# Altium schematic sheet FastCharge.SchDoc
size A
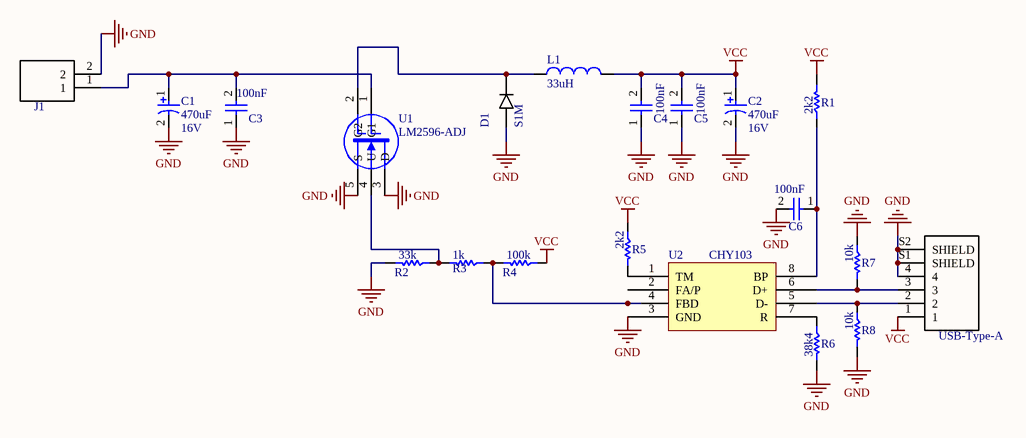
[diagram p0: FastCharge.SchDoc]

## Parts
C1  470uF  [RB5-10.5]
C2  470uF  [RB5-10.5]
C3  100nF  [6-0805_L]
C4  100nF  [6-0805_L]
C5  100nF  [6-0805_L]
C6  100nF  [6-0805_L]
D1  S1M  [*DIOM5227X270N_S1M(Primary)]
J1  6-1123723-2  [*TE_6-1123723-2]  (value not drawn)
L1  33uH  [IND_SMD-13.0mm]
R1  2k2  [6-0805_L]
R2  33k  [6-0805_L]
R3  1k  [6-0805_L]
R4  100k  [6-0805_L]
R5  2k2  [6-0805_L]
R6  38k4  [6-0805_L]
R7  10k  [6-0805_L]
R8  10k  [6-0805_L]
U1  LM2596-ADJ  [T05A]
U2  CHY103  [8 pin SOIC_L]
USB-Type-A  1-292303-1  [*TE_1-292303-1_1-292303-1(Primary)]  (value not drawn)

## Nets
GND: C1.2 C2.2 C3.1 C4.1 C5.1 C6.2 D1.A J1.2 R2.2 R6.2 R7.1 R8.2 U1.3(D) U1.5(S) U2.3(GND) USB-Type-A.4 USB-Type-A.S1(SHIELD) USB-Type-A.S2(SHIELD)
VCC: C2.1 C4.2 C5.2 L1.2 R1.2 R4.1 R5.1 USB-Type-A.1
NetC1_1: C1.1 C3.2 J1.1 U1.1(G1)
NetC6_1: C6.1 R1.1 U2.8(BP)
NetD1_C: D1.C(K) L1.1 U1.2(G2)
NetR2_1: R2.1 R3.2 U1.4(U)
NetR3_1: R3.1 R4.2 U2.4(FBD)
NetR5_2: R5.2 U2.1(TM)
NetR6_1: R6.1 U2.7(R)
NetR7_2: R7.2 U2.6(D+) USB-Type-A.3
NetR8_1: R8.1 U2.5(D-) USB-Type-A.2

Not connected (* = marked no-connect by the designer): U2 2(FA/P)

## Notes on the sheet
- (in symbol CAP) 16V

## Library data of the parts
C1 C2 = CAP
C3-C6 = CAP NON
D1 = S1M: S1 Series 1000 V 1 A 1 uA Surface Mount General Purpose Rectifier - DO-214AC; MF: ON Semiconductor; Price: None; Availability: Unavailable; SnapEDA_Link: https://www.snapeda.com/parts/S1M/ON%20Semiconductor/view-part/?ref=snap; Package: DO-214AC-214 ON Semiconductor; MP: S1M; Value: *
J1 = 6-1123723-2: 3.96 EP HDR ASSY 2P_GREEN_; MF: TE Connectivity; Number_of_Positions: 2; Product_Type: Header; Centerline_Pitch: 3.96 mm[.156 in]; TE_purchase_URL: https://www.te.com/usa-en/product-6-1123723-2.html?te_bu=Cor&te_type=disp&te_campaign=seda_glo_cor-seda-global-disp-prtnr-fy19-seda-model-bom-cta_sma-317_1&elqCampaignId=32493; MP: 6-1123723-2; Price: None; Availability: Unavailable; Package: None; EU_RoHS_Compliance: Compliant; SnapEDA_Link: https://www.snapeda.com/parts/6-1123723-2/TE%20Connectivity%20AMP%20Connectors/view-part/?ref=snap; Value: *
L1 = Inductor
R1-R8 = RESISTOR
U1 = MOSFET-N3: Two-Gate, N-Channel MOSFET, Externally Terminated Substrate; Published: 24-Mar-1999; LatestRevisionDate: 17-Jul-2002; LatestRevisionNote: Re-released for DXP Platform.; PackageReference: T05A; Publisher: Altium Limited; PackageDescription: TO-220, Molded, 5 Lead, Straight; Code_JEDEC: TS-001-AA
USB-Type-A = 1-292303-1: Conn USB 2.0 Type A RCP 4 POS Solder RA SMD 4 Terminal 1 Port Box/Tray; MF: TE Connectivity; TE_purchase_URL: https://www.te.com/usa-en/product-1-292303-1.html?te_bu=Cor&te_type=disp&te_campaign=seda_glo_cor-seda-global-disp-prtnr-fy19-seda-model-bom-cta_sma-317_1&elqCampaignId=32493; SnapEDA_Link: https://www.snapeda.com/parts/1-292303-1/TE%20Connectivity%20AMP%20Connectors/view-part/?ref=snap; MP: 1-292303-1; Availability: Unavailable; Price: None; EU_RoHS_Compliance: Compliant; Package: None; Value: *